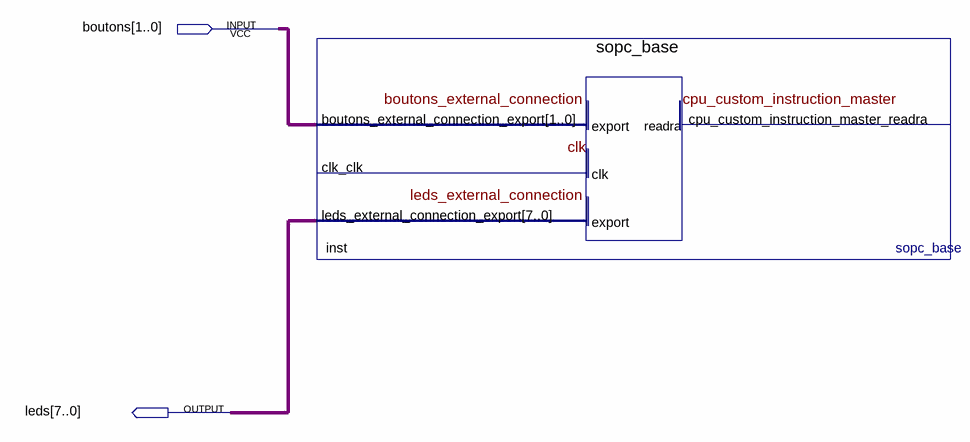
[diagram p0: schematic sheet]
// Quartus schematic sopc_base1.bdf as structural Verilog: 1 symbols, 2 pins
module sopc_base1 (
  input  [1:0] boutons,
  output [7:0] leds
);

  sopc_base inst (
    .boutons_external_connection_export(boutons), .leds_external_connection_export(leds));  // open: clk_clk, cpu_custom_instruction_master_readra
endmodule
